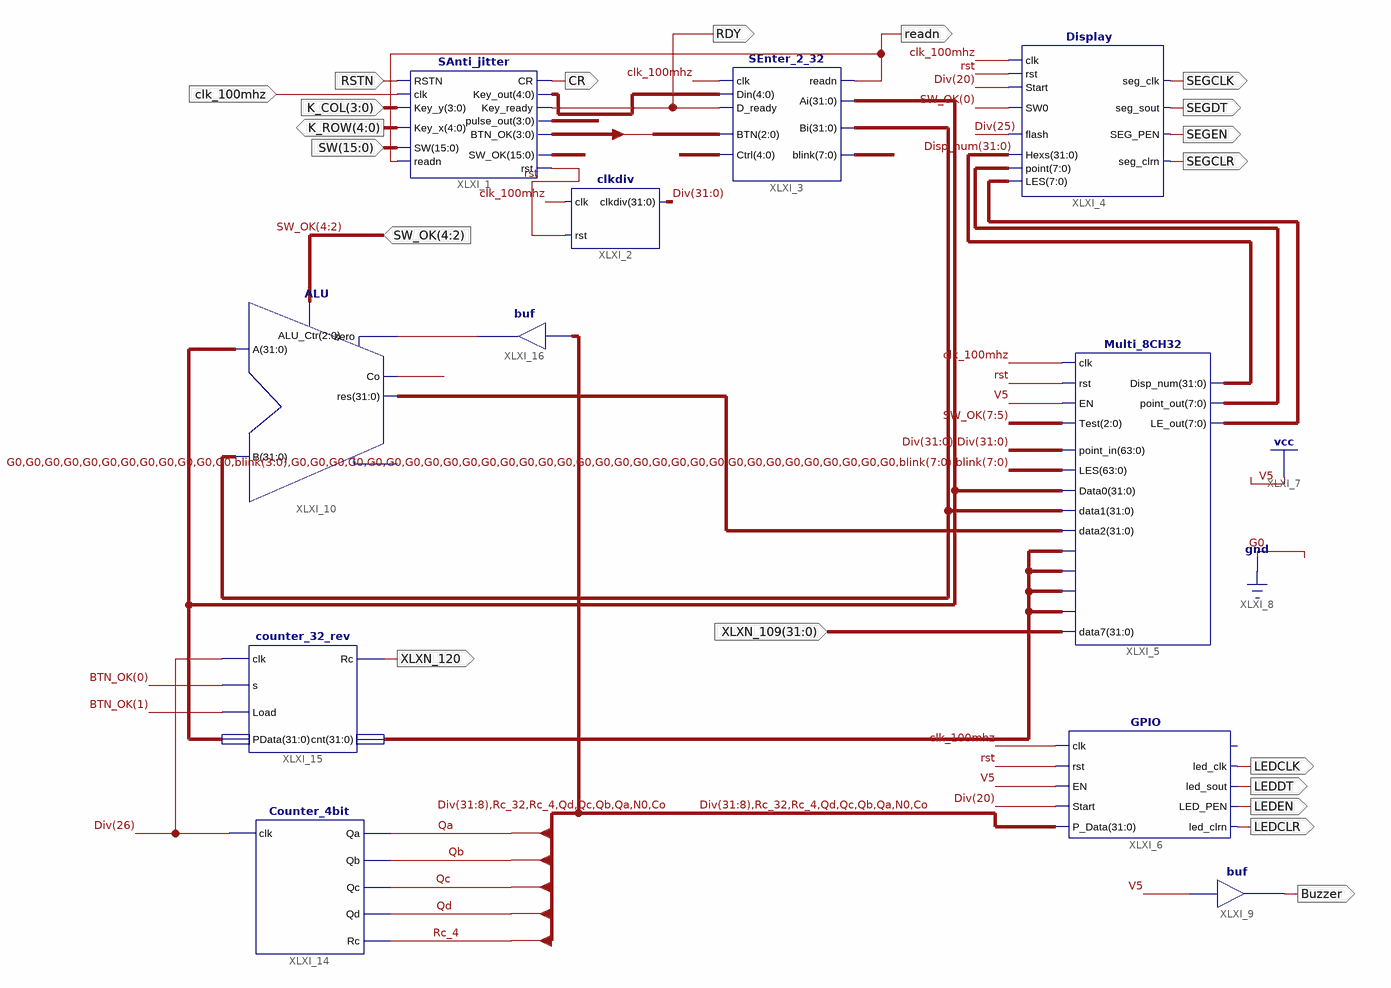
[diagram p0: schematic sheet 1]
// Xilinx ISE schematic Framework.sch (kintex7) as structural Verilog: 11 symbols, 20 ports
module Framework (
  input  RSTN,
  input  [3:0] K_COL,
  input  [15:0] SW,
  input  clk_100mhz,
  input  [15:0] SW_OK,
  input  [31:0] XLXN_109,
  output [4:0] K_ROW,
  output CR,
  output RDY,
  output SEGCLK,
  output SEGDT,
  output SEGEN,
  output SEGCLR,
  output LEDCLK,
  output LEDDT,
  output LEDEN,
  output LEDCLR,
  output readn,
  output Buzzer,
  output XLXN_120
);

  wire Co, N0, Qa, Qb, Qc, Qd, Rc_4, Rc_32, rst, zero;
  wire [3:0] BTN_OK, Pulse;
  wire [4:0] XLXN_70;
  wire [7:0] blink, LE_out, point_out;
  wire [31:0] Disp_num, Div, XLXN_71, XLXN_72, XLXN_108, XLXN_110;

  SAnti_jitter XLXI_1 (
    .SW(SW), .readn(readn), .Key_y(K_COL), .Key_x(K_ROW), .RSTN(RSTN), .clk(clk_100mhz), .Key_out(XLXN_70),
    .Key_ready(RDY), .CR(CR), .rst(rst), .SW_OK(SW_OK), .pulse_out(Pulse), .BTN_OK(BTN_OK));
  clkdiv XLXI_2 (.rst(rst), .clkdiv(Div), .clk(clk_100mhz));
  SEnter_2_32 XLXI_3 (
    .readn(readn), .Ai(XLXN_71), .Bi(XLXN_72), .blink(blink), .Din(XLXN_70), .D_ready(RDY), .clk(clk_100mhz),
    .Ctrl({SW_OK[7:5], SW_OK[15], SW_OK[0]}), .BTN(BTN_OK[2:0]));
  Display XLXI_4 (
    .LES(LE_out), .SEG_PEN(SEGEN), .seg_sout(SEGDT), .seg_clrn(SEGCLR), .point(point_out), .Hexs(Disp_num),
    .SW0(SW_OK[0]), .flash(Div[25]), .seg_clk(SEGCLK), .clk(clk_100mhz), .rst(rst), .Start(Div[20]));
  Multi_8CH32 XLXI_5 (
    .Test(SW_OK[7:5]), .point_in({Div, Div}), .EN(1'b1), .clk(clk_100mhz), .rst(rst),
    .LES({{12{1'b0}}, blink[3:0], {32{1'b0}}, blink, blink}), .Data0(XLXN_71), .data1(XLXN_72),
    .data2(XLXN_108), .data3(XLXN_110), .data4(XLXN_110), .data5(XLXN_110), .data6(XLXN_110),
    .data7(XLXN_109), .point_out(point_out), .LE_out(LE_out), .Disp_num(Disp_num));
  GPIO XLXI_6 (
    .clk(clk_100mhz), .P_Data({Div[31:8], Rc_32, Rc_4, Qd, Qc, Qb, Qa, N0, Co}), .rst(rst), .EN(1'b1),
    .Start(Div[20]), .led_clrn(LEDCLR), .led_clk(LEDCLK), .led_sout(LEDDT), .LED_PEN(LEDEN));  // open: GPIOf0
  buf XLXI_9 (Buzzer, 1'b1);
  ALU XLXI_10 (.A(XLXN_71), .B(XLXN_72), .res(XLXN_108), .zero(zero), .Co(Co), .ALU_Ctr(SW_OK[4:2]));  // open: overflow
  Counter_4bit XLXI_14 (.clk(Div[26]), .Qa(Qa), .Qb(Qb), .Qc(Qc), .Qd(Qd), .Rc(Rc_4));
  counter_32_rev XLXI_15 (
    .clk(Div[26]), .s(BTN_OK[0]), .Load(BTN_OK[1]), .PData(XLXN_71), .Rc(XLXN_120), .cnt(XLXN_110));
  assign zero = {Div[31:8], Rc_32, Rc_4, Qd, Qc, Qb, Qa, N0, Co};  // buf XLXI_16, 32 bits wide
endmodule
